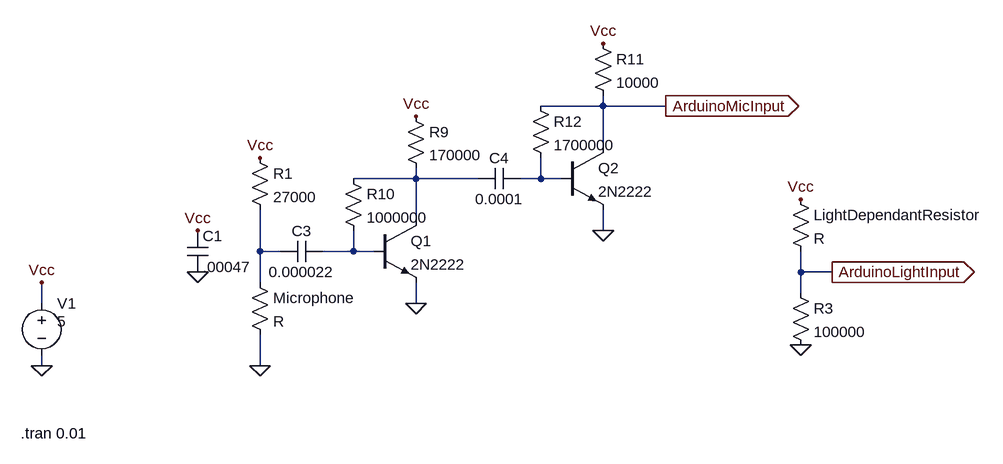
[diagram p0: schematic Analog.asc]
Analog.asc, the LTspice schematic file:
Version 4
SHEET 1 2644 680
WIRE 832 -208 832 -224
WIRE 832 -208 736 -208
WIRE 928 -208 832 -208
WIRE 832 -144 832 -208
WIRE 544 -96 544 -112
WIRE 544 -96 448 -96
WIRE 640 -96 544 -96
WIRE 736 -96 736 -128
WIRE 736 -96 704 -96
WIRE 768 -96 736 -96
WIRE 544 -32 544 -96
WIRE 832 -16 832 -48
WIRE 304 16 304 -48
WIRE 336 16 304 16
WIRE 448 16 448 -16
WIRE 448 16 400 16
WIRE 480 16 448 16
WIRE 1136 48 1136 16
WIRE 1184 48 1136 48
WIRE 304 64 304 16
WIRE 1136 80 1136 48
WIRE -32 96 -32 64
WIRE 544 96 544 64
WIRE -32 192 -32 176
WIRE 304 192 304 144
FLAG -32 192 0
FLAG -32 64 Vcc
FLAG 304 192 0
FLAG 544 96 0
FLAG 544 -192 Vcc
FLAG 832 -16 0
FLAG 832 -304 Vcc
FLAG 304 -128 Vcc
FLAG 1136 -64 Vcc
FLAG 1136 160 0
FLAG 928 -208 ArduinoMicInput
IOPIN 928 -208 Out
FLAG 1184 48 ArduinoLightInput
IOPIN 1184 48 Out
FLAG 208 -16 Vcc
FLAG 208 48 0
SYMBOL voltage -32 80 R0
WINDOW 3 24 44 Left 2
WINDOW 123 0 0 Left 2
WINDOW 39 0 0 Left 2
SYMATTR Value 5
SYMATTR InstName V1
SYMBOL cap 400 0 R90
WINDOW 0 0 32 VBottom 2
WINDOW 3 32 32 VTop 2
SYMATTR InstName C3
SYMATTR Value 0.000022
SYMBOL npn 480 -32 R0
SYMATTR InstName Q1
SYMATTR Value 2N2222
SYMBOL res 528 -208 R0
SYMATTR InstName R9
SYMATTR Value 170000
SYMBOL res 432 -112 R0
SYMATTR InstName R10
SYMATTR Value 1000000
SYMBOL cap 704 -112 R90
WINDOW 0 0 32 VBottom 2
WINDOW 3 32 32 VTop 2
SYMATTR InstName C4
SYMATTR Value 0.0001
SYMBOL npn 768 -144 R0
SYMATTR InstName Q2
SYMATTR Value 2N2222
SYMBOL res 816 -320 R0
SYMATTR InstName R11
SYMATTR Value 10000
SYMBOL res 720 -224 R0
SYMATTR InstName R12
SYMATTR Value 1700000
SYMBOL res 288 -144 R0
SYMATTR InstName R1
SYMATTR Value 27000
SYMBOL res 1120 64 R0
SYMATTR InstName R3
SYMATTR Value 100000
SYMBOL res 288 48 R0
SYMATTR InstName Microphone
SYMBOL res 1120 -80 R0
SYMATTR InstName LightDependantResistor
SYMBOL cap 192 -16 R0
SYMATTR InstName C1
SYMATTR Value .00047
TEXT -64 296 Left 2 !.tran 0.01

The netlist it stands for:
* Analog.asc
V1 Vcc 0 5
C3 N004 N003 0.000022
Q1 N001 N004 0 0 2N2222
R9 Vcc N001 170000
R10 N001 N004 1000000
C4 N002 N001 0.0001
Q2 ArduinoMicInput N002 0 0 2N2222
R11 Vcc ArduinoMicInput 10000
R12 ArduinoMicInput N002 1700000
R1 Vcc N003 27000
R3 ArduinoLightInput 0 100000
R§Microphone N003 0 R
R§LightDependantResistor Vcc ArduinoLightInput R
C1 Vcc 0 .00047
.model NPN NPN
.model PNP PNP
.lib standard.bjt
.tran 0.01
.backanno
.end